# EAGLE design NodegLCD.mega128.v1 (EAGLE 4.13)
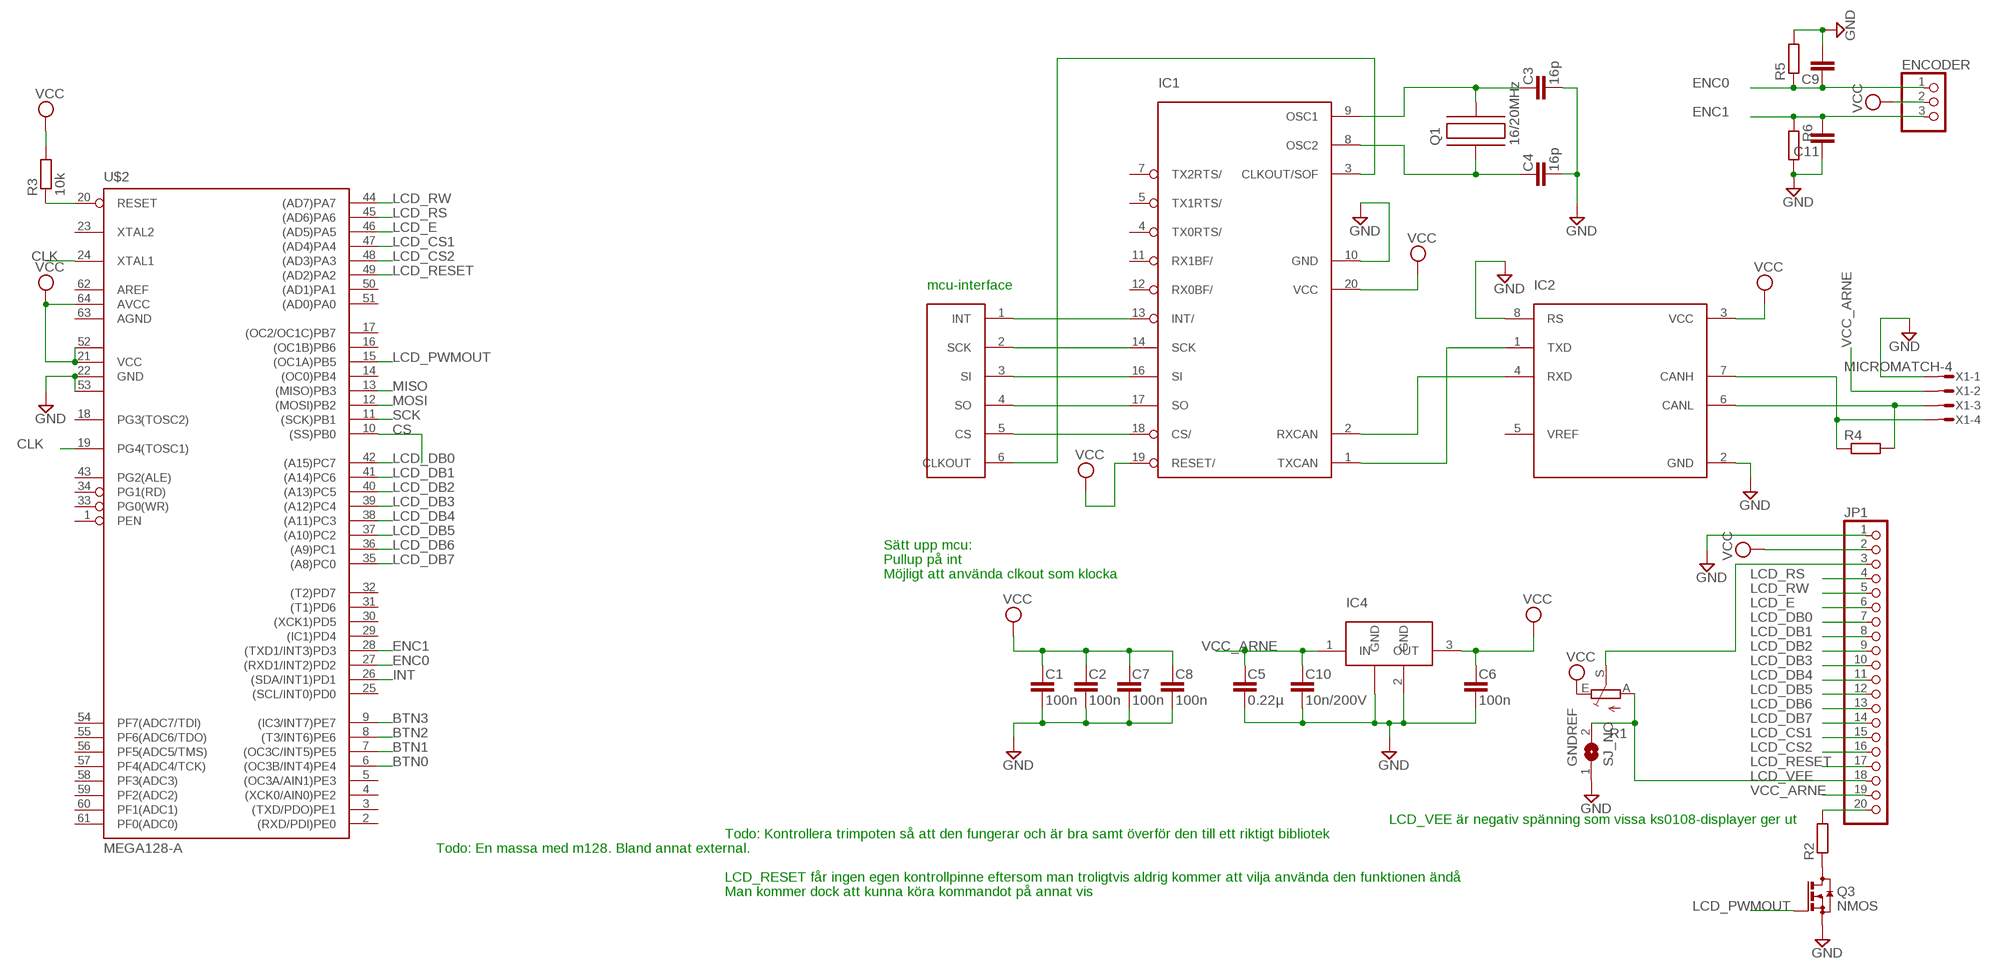
[diagram p0: schematic, sheet 1]

## Parts
C1  100n  C-EU  [C0603]
C2  100n  C-EU  [C0603]
C3  16p  C-EU  [C0603]
C4  16p  C-EU  [C0603]
C5  0.22µ  C-EU  [C0603]
C6  100n  C-EU  [C0603]
C7  100n  C-EU  [C0603]
C8  100n  C-EU  [C0603]
C9  C-EU  [C0603]
C10  10n/200V  C-EU  [C0603]
C11  C-EU  [C0603]
ENCODER  PINHD-1X3  [1X03]
GNDREF  SJ_NO  [SJ_NO]
IC1  MCP2515  [TSSOP]
IC2  MCP2551  [SOIC]
IC4  LM340MP-5.0  [SOT223]
JP1  PINHD-2X10  [2X10]
Q1  16/20MHz  C-MAC-LFA147E  [SMD]
Q3  NMOS  [SOT23]
R1  TRIM_EU-CA9H  [CA9H]
R2  R-EU0207/2V  [0207/2V]
R3  10k  R-EUR0603  [R0603]
R4  R-EUR0603  [R0603]
R5  R-EUR0603  [R0603]
R6  R-EUR0603  [R0603]
U$1  CAN-INTERFACE  [VIA-LIST]
U$2  MEGA128-A  [TQFP64]
X1  MICROMATCH-4  [MICROMATCH-4]

## Nets
BTN0: U$2.6((OC3B/INT4)PE4)
BTN1: U$2.7((OC3C/INT5)PE5)
BTN2: U$2.8((T3/INT6)PE6)
BTN3: U$2.9((IC3/INT7)PE7)
CANH: IC2.7(CANH) R4.1 X1.4
CANL: IC2.6(CANL) R4.2 X1.3
CLK: IC1.3(CLKOUT/SOF) U$1.6(CLKOUT) U$2.19(PG4(TOSC1)) U$2.24(XTAL1)
CS: IC1.18(CS/) U$1.5(CS) U$2.10((SS)PB0)
ENC0: C9.1 ENCODER.1 R5.1 U$2.27((RXD1/INT2)PD2)
ENC1: C11.2 ENCODER.3 R6.1 U$2.28((TXD1/INT3)PD3)
GND: C1.2 C2.2 C3.2 C4.2 C5.2 C6.2 C7.2 C8.2 C9.2 C10.2 C11.1 GNDREF.1 IC1.10(GND) IC2.2(GND) IC2.8(RS) IC4.2(GND) IC4.4(GND) JP1.1 Q3.2(S) R5.2 R6.2 U$2.22(GND) U$2.53(GND1) X1.1
INT: IC1.13(INT/) U$1.1(INT) U$2.26((SDA/INT1)PD1)
LCD_CONTRAST: JP1.3 R1.S
LCD_CS1: JP1.15 U$2.47((AD4)PA4)
LCD_CS2: JP1.16 U$2.48((AD3)PA3)
LCD_DB0: JP1.7 U$2.42((A15)PC7)
LCD_DB1: JP1.8 U$2.41((A14)PC6)
LCD_DB2: JP1.9 U$2.40((A13)PC5)
LCD_DB3: JP1.10 U$2.39((A12)PC4)
LCD_DB4: JP1.11 U$2.38((A11)PC3)
LCD_DB5: JP1.12 U$2.37((A10)PC2)
LCD_DB6: JP1.13 U$2.36((A9)PC1)
LCD_DB7: JP1.14 U$2.35((A8)PC0)
LCD_E: JP1.6 U$2.46((AD5)PA5)
LCD_PWMOUT: Q3.1(G) U$2.15((OC1A)PB5)
LCD_RESET: JP1.17 U$2.49((AD2)PA2)
LCD_RS: JP1.4 U$2.45((AD6)PA6)
LCD_RW: JP1.5 U$2.44((AD7)PA7)
LCD_VEE: GNDREF.2 JP1.18 R1.A
MISO: IC1.17(SO) U$1.4(SO) U$2.13((MISO)PB3)
MOSI: IC1.16(SI) U$1.3(SI) U$2.12((MOSI)PB2)
N$1: IC1.2(RXCAN) IC2.4(RXD)
N$2: IC1.1(TXCAN) IC2.1(TXD)
N$3: Q3.3(D) R2.1
N$4: JP1.20 R2.2
N$5: R3.1 U$2.20(RESET)
N$12: C3.1 IC1.9(OSC1) Q1.P$2
N$13: C4.1 IC1.8(OSC2) Q1.P$1
SCK: IC1.14(SCK) U$1.2(SCK) U$2.11((SCK)PB1)
VCC: C1.1 C2.1 C6.1 C7.1 C8.1 ENCODER.2 IC1.19(RESET/) IC1.20(VCC) IC2.3(VCC) IC4.3(OUT) JP1.2 R1.E R3.2 U$2.21(VCC) U$2.52(VCC1) U$2.64(AVCC)
VCC_ARNE: C5.1 C10.1 IC4.1(IN) JP1.19 X1.2
Unconnected: IC1.4(TX0RTS/) IC1.5(TX1RTS/) IC1.7(TX2RTS/) IC1.11(RX1BF/) IC1.12(RX0BF/) IC2.5(VREF) U$2.1(PEN) U$2.2((RXD/PDI)PE0) U$2.3((TXD/PDO)PE1) U$2.4((XCK0/AIN0)PE2) U$2.5((OC3A/AIN1)PE3) U$2.14((OC0)PB4) U$2.16((OC1B)PB6) U$2.17((OC2/OC1C)PB7) U$2.18(PG3(TOSC2)) U$2.23(XTAL2) U$2.25((SCL/INT0)PD0) U$2.29((IC1)PD4) U$2.30((XCK1)PD5) U$2.31((T1)PD6) U$2.32((T2)PD7) U$2.33(PG0(WR)) U$2.34(PG1(RD)) U$2.43(PG2(ALE)) U$2.50((AD1)PA1) U$2.51((AD0)PA0) U$2.54(PF7(ADC7/TDI)) U$2.55(PF6(ADC6/TDO)) U$2.56(PF5(ADC5/TMS)) U$2.57(PF4(ADC4/TCK)) U$2.58(PF3(ADC3)) U$2.59(PF2(ADC2)) U$2.60(PF1(ADC1)) U$2.61(PF0(ADC0)) U$2.62(AREF) U$2.63(AGND)

## Notes on the sheet
- mcu-interface
- Sätt upp mcu:
- Pullup på int
- Möjligt att använda clkout som klocka
- LCD_VEE är negativ spänning som vissa ks0108-displayer ger ut
- Todo: Kontrollera trimpoten så att den fungerar och är bra samt överför den till ett riktigt bibliotek
- Todo: En massa med m128. Bland annat external.
- LCD_RESET får ingen egen kontrollpinne eftersom man troligtvis aldrig kommer att vilja använda den funktionen ändå
- Man kommer dock att kunna köra kommandot på annat vis

## Library data of the parts
C1-C11 = rcl:C-EU
ENCODER = pinhead-mm:PINHD-1X3
GNDREF = jumper:SJ_NO
IC1 = mcp2515:MCP2515
IC2 = mcp2551:MCP2551
IC4 = lm340mp:LM340MP-5.0
JP1 = pinhead-mm:PINHD-2X10
Q1 = hc49-4h-smx:C-MAC-LFA147E
Q3 = transistor:NMOS
R1 = pot:TRIM_EU-: POTENTIOMETER
R2-R6 = rcl:R-EU
U$1 = can-interface:CAN-INTERFACE
U$2 = avr:MEGA128: MICROCONTROLLER 128 Kbytes FLASH 4 Kbytes SRAM 4 Kbytes EEPROM DUAL USART 8-channel 10 bit ADC
X1 = con-amp-micromatch:MICROMATCH-4: MicroMaTch 4 7-215464-4 / 0-215464-4 Drawing Number C-215464 DDEController.pdf

## Board
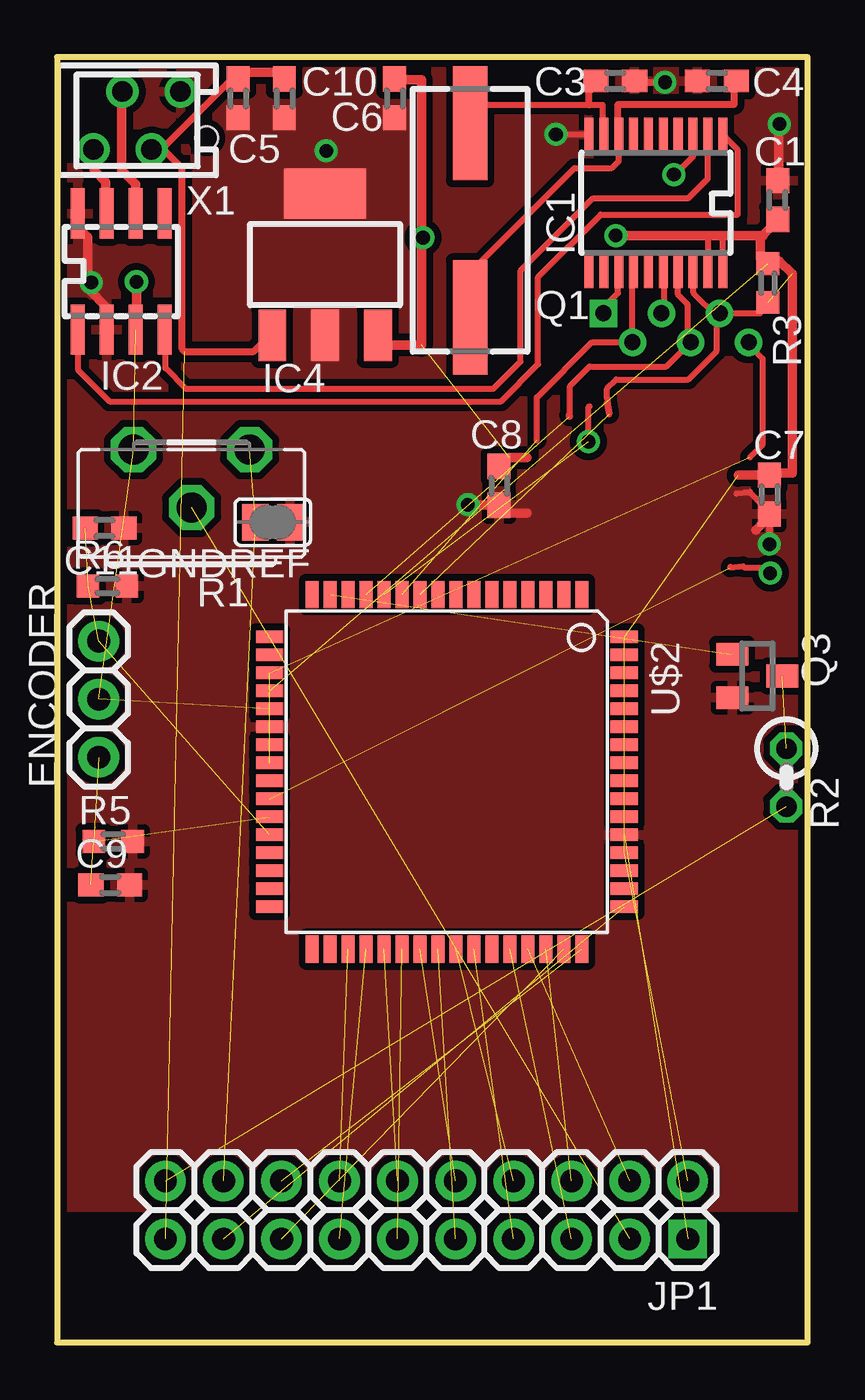
[diagram p1: board, top side]
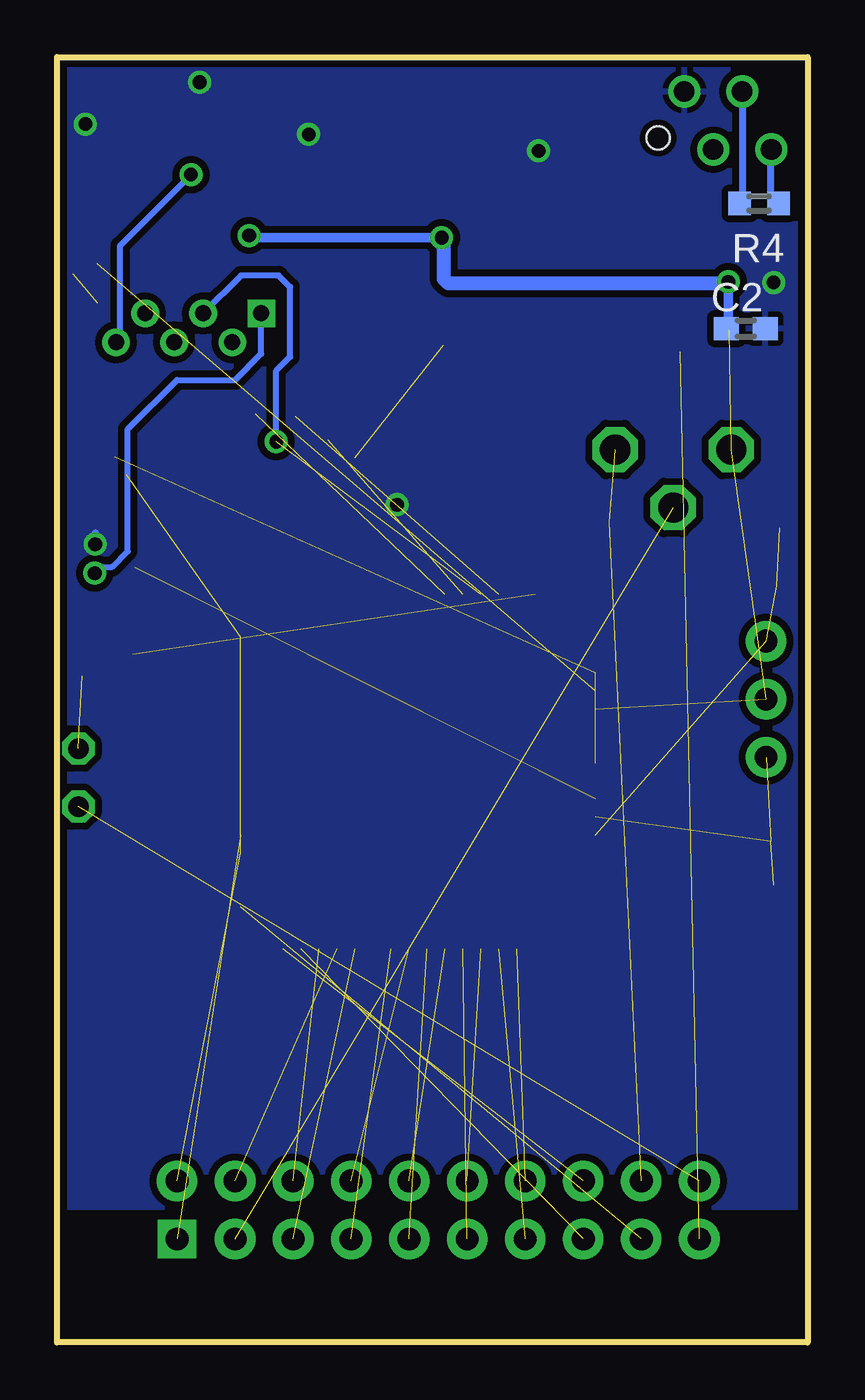
[diagram p2: board, bottom side, seen from below]

Size 32.85 x 56.24 mm. Coordinates in mm from the lower left corner, seen from the top.
Outline: 0,0 32.85,0 32.85,56.24 0,56.24 0,0
Copper layers (1*16): Top 0.035mm / dielectric 1.5mm / Bottom 0.035mm
Design rules "10mils, 0.6drill": minimum track width 10mil, minimum drill 0.6mm, track to track 10mil, track to pad 10mil, pad to pad 10mil, via to via 10mil, smd to smd 10mil, copper to edge 10mil, drill to drill 10mil, minimum pad ring 10mil, minimum via ring 8mil, stop-mask expansion 0mil, vias tented up to drill 0mil, thermal gap 10mil

### Footprints (pad centres in the part's own frame; a part is rotated, then mirrored left to right if it is on the bottom)
C0603 = smd 1.1 x 1: 1 -0.85,0; 2 0.85,0
1X03 = drill 1 pad 1.778 round: 1 -2.54,0; 2 0,0; 3 2.54,0
SJ_NO = smd 1.168 x 1.6: 1 -0.762,0; 2 0.762,0
TSSOP = smd 0.396 x 1.5: 1 -2.925,-2.975; 2 -2.275,-2.975; 3 -1.625,-2.975; 4 -0.975,-2.975; 5 -0.325,-2.975; 6 0.325,-2.975; 7 0.975,-2.975; 8 1.625,-2.975; 9 2.275,-2.975; 10 2.925,-2.975; 11 2.925,2.975; 12 2.275,2.975; 13 1.625,2.975; 14 0.975,2.975; 15 0.325,2.975; 16 -0.325,2.975; 17 -0.975,2.975; 18 -1.625,2.975; 19 -2.275,2.975; 20 -2.925,2.975
SOIC = smd 0.6 x 2.2: 1 -1.905,-2.54; 2 -0.635,-2.54; 3 0.635,-2.54; 4 1.905,-2.54; 5 1.905,2.54; 6 0.635,2.54; 7 -0.635,2.54; 8 -1.905,2.54
SOT223 = smd 1.219 x 2.235: 1 -2.311,-3.099; 2 0,-3.099; 3 2.311,-3.099 | smd 3.6 x 2.2: 4 0,3.099
2X10 = drill 1 pad 1.676 square: 1 -10.16,1.27 | drill 1 pad 1.778 round: 2 -10.16,-1.27; 3 -7.62,1.27; 4 -7.62,-1.27; 5 -5.08,1.27; 6 -5.08,-1.27; 7 -2.54,1.27; 8 -2.54,-1.27; 9 0,1.27; 10 0,-1.27; 11 2.54,1.27; 12 2.54,-1.27; 13 5.08,1.27; 14 5.08,-1.27; 15 7.62,1.27; 16 7.62,-1.27; 17 10.16,1.27; 18 10.16,-1.27; 19 12.7,1.27; 20 12.7,-1.27
SMD = smd 5 x 1.5: P$1 4.25,0; P$2 -4.25,0
SOT23 = smd 1 x 1.4: 1 -0.95,-1.1; 2 0.95,-1.1; 3 0,1.1
CA9H = drill 1.321 octagon: A -2.54,0; E 2.54,0; S 0,2.54
0207/2V = drill 0.9 octagon: 1 -1.27,0; 2 1.27,0
R0603 = smd 0.991 x 1.016: 1 -0.85,0; 2 0.85,0
VIA-LIST = drill 0.7 square: 1 0,2.54 | drill 0.7 round: 2 -1.27,1.27; 3 0,0; 4 -1.27,-1.27; 5 0,-2.54; 6 -1.27,-3.81
TQFP64 = smd 1.194 x 0.559: 1 -7.76,5.905; 2 -7.76,5.118; 3 -7.76,4.331; 4 -7.76,3.543; 5 -7.76,2.756; 6 -7.76,1.968; 7 -7.76,1.181; 8 -7.76,0.394; 9 -7.76,-0.394; 10 -7.76,-1.181; 11 -7.76,-1.968; 12 -7.76,-2.756; 13 -7.76,-3.543; 14 -7.76,-4.331; 15 -7.76,-5.118; 16 -7.76,-5.905; 33 7.76,-5.905; 34 7.76,-5.118; 35 7.76,-4.331; 36 7.76,-3.543; 37 7.76,-2.756; 38 7.76,-1.968; 39 7.76,-1.181; 40 7.76,-0.394; 41 7.76,0.394; 42 7.76,1.181; 43 7.76,1.968; 44 7.76,2.756; 45 7.76,3.543; 46 7.76,4.331; 47 7.76,5.118; 48 7.76,5.905 | smd 0.559 x 1.194: 17 -5.905,-7.76; 18 -5.118,-7.76; 19 -4.331,-7.76; 20 -3.543,-7.76; 21 -2.756,-7.76; 22 -1.968,-7.76; 23 -1.181,-7.76; 24 -0.394,-7.76; 25 0.394,-7.76; 26 1.181,-7.76; 27 1.968,-7.76; 28 2.756,-7.76; 29 3.543,-7.76; 30 4.331,-7.76; 31 5.118,-7.76; 32 5.905,-7.76; 49 5.905,7.76; 50 5.118,7.76; 51 4.331,7.76; 52 3.543,7.76; 53 2.756,7.76; 54 1.968,7.76; 55 1.181,7.76; 56 0.394,7.76; 57 -0.394,7.76; 58 -1.181,7.76; 59 -1.968,7.76; 60 -2.756,7.76; 61 -3.543,7.76; 62 -4.331,7.76; 63 -5.118,7.76; 64 -5.905,7.76
MICROMATCH-4 = drill 0.9 round: 1 1.905,1.27; 2 0.635,-1.27; 3 -0.635,1.27; 4 -1.905,-1.27 | hole 1: 3.048,-0.762

### Placement (x,y rotation side)
C1  31.54,49.99 90 top
C2  2.7,44.36 0 bottom
C3  24.43,55.2 0 top
C4  28.87,55.2 180 top
C5  7.92,54.43 270 top
C6  14.77,54.43 270 top
C7  31.17,37.1 270 top
C8  19.34,37.48 270 top
C9  2.33,20.02 0 top
C10  9.95,54.43 270 top
C11  2.07,35.64 180 top
ENCODER  1.82,28.14 90 top
GNDREF  9.44,35.89 180 top
IC1  26.21,49.86 180 top
IC2  2.8,46.86 0 top
IC4  11.73,47.17 0 top
JP1  17.44,5.79 180 top
Q1  18.08,49.1 270 top
Q3  30.65,29.16 270 top
R1  5.88,39.07 180 top
R2  31.92,24.72 270 top
R3  31.11,46.36 270 top
R4  2.12,49.84 180 bottom
R5  2.46,21.92 0 top
R6  2.2,33.1 0 top
U$1  26.46,45.04 90 top
U$2  17.06,24.97 270 top
X1  3.5,53.47 0 top

### Tracks (layer width: path | path; a pad name or v marks a point on that pad's centre or on a via)
CANH
  Top 0.305: 2.12,49.44 IC2.7 | X1.4 1.62,52.2
  Top 0.406: 2.12,49.44 2.12,50.78 1.62,51.28 1.62,52.2
  Bottom 0.305: X1.4 1.62,52.2 1.62,50.18 R4.1
CANL
  Top 0.305: IC2.6 | X1.3 2.84,54.74
  Top 0.406: IC2.6 3.45,50.67 2.84,51.28 2.84,54.74
  Bottom 0.305: X1.3 2.84,54.74 2.84,49.97 R4.2
CLK  (via drill 0.6)  (2 unrouted)
  Top 0.254: IC1.3 27.83,52.73 27.83,51.89 27.02,51.08 v26.99,51.11 | 30.32,38.74 30.88,39.3 30.88,43.05 30.22,43.71 30.17,43.77
  Top 0.406: 30.17,43.66 30.22,43.71 U$1.6
  Bottom 0.254: v26.99,51.11 30.09,47.98 30.09,43.92 U$1.6
CS  (1 unrouted)
  Top 0.254: IC1.18 27.83,47.01 27.86,47.01 27.86,45.92 28.87,44.91 | 24.07,41.14 24.07,41.12 24.17,40.62 24.07,41.33 24.07,41.73 24.48,42.14 27.63,42.14 28.87,43.38 28.87,44.91 | 28.87,44.91 U$1.5 30.78,45.04 31.03,45.29 31.03,45.49 30.97,45.49
ENC0  (3 unrouted)
ENC1  (3 unrouted)
GND  (via drill 0.6)  (1 unrouted)
  Top 0.254: v21.84,52.86 23.28,52.86 IC1.10 | C1.2 31.59,51.16 | 1.34,46.13 v1.49,46.38 | C8.2 19.8,36.3 | C7.2 31.11,36.58 30.93,36.58 30.32,37.21 29.76,37.16 29.74,37.14 | v31.61,53.32 31.44,53.27 31.59,53.11
  Top 0.305: IC2.2 2.2,44.65 | C3.2 25.45,55.14 v26.61,55.14 | 30.93,36.58 31.16,36.58 31.18,36.55 31.18,36.04 v31.18,34.93
  Top 0.406: 2.2,44.65 2.2,45.26 1.34,46.13 1.34,48.36 0.83,48.87 IC2.8 | 19.8,36.3 20.56,36.3 | 31.59,51.16 31.59,53.11 | 31.18,36.04 31.08,36.04 30.58,35.54 | C8.2 18,36.63 v17.97,36.65
  Bottom 0.305: v26.61,55.14 26.56,55.22 | v31.18,34.93 31.18,35.43
  Bottom 0.406: v17.97,36.65 18.08,36.65
  other vias: 11.78,52.14
  pour Bottom (isolate 0.305): 0.12,56.13 32.83,56.13 32.83,5.94 24.38,5.94 0.12,5.94
  pour Top (isolate 0.305, no thermals): 5.83,55.77 15.89,55.77 15.89,42.05 5.83,42.05
  pour Top (isolate 0.305): 0.17,56.08 32.68,56.08 32.68,5.92 0.17,5.92
INT  (via drill 0.6)  (1 unrouted)
  Top 0.254: IC1.13 | IC1.13 | U$1.1 23.92,45.29 24.55,45.92 24.55,46.86 IC1.13 | 29.48,33.94 29.46,33.91 30.01,33.96 30.07,33.91 30.95,33.91 v31.21,33.66
  Bottom 0.254: v31.21,33.66 30.9,33.94 30.45,33.94 29.76,34.62 29.76,39.96 27.6,42.11 25.06,42.11 23.92,43.26 U$1.1
LCD_CONTRAST  (1 unrouted)
LCD_CS1  (1 unrouted)
LCD_CS2  (1 unrouted)
LCD_DB0  (1 unrouted)
LCD_DB1  (1 unrouted)
LCD_DB2  (1 unrouted)
LCD_DB3  (1 unrouted)
LCD_DB4  (1 unrouted)
LCD_DB5  (1 unrouted)
LCD_DB6  (1 unrouted)
LCD_DB7  (1 unrouted)
LCD_E  (1 unrouted)
LCD_PWMOUT  (1 unrouted)
LCD_RESET  (1 unrouted)
LCD_RS  (1 unrouted)
LCD_RW  (1 unrouted)
LCD_VEE  (2 unrouted)
MISO  (1 unrouted)
  Top 0.254: IC1.17 27.18,46.95 27.17,46.94 27.17,45.85 27.6,45.42 27.6,44.02 27.73,43.89 U$1.4 26.66,42.7 23.31,42.7 22.45,41.84 22.45,40.51 22.44,40.51 22.41,40.51 22.39,40.58
MOSI  (via drill 0.6)  (1 unrouted)
  Top 0.254: IC1.16 26.53,47.01 26.51,46.99 26.51,46.76 26.58,46.69 26.58,45.16 U$1.3 | 23.3,40.96 23.26,40.92 v23.26,39.42
  Bottom 0.254: U$1.3 26.51,45.09 | U$1.3 26.41,44.98 | v23.26,39.42 23.26,42.52 22.65,43.13 22.65,46.18 23.16,46.69 24.81,46.69 U$1.3
N$1
  Top 0.254: 4.77,44.27 4.75,44.27 IC2.4 4.71,44.3 4.74,44.27 4.74,42.62 5.63,41.73 19.09,41.73 20.29,42.93 20.29,46.89 23.46,50.06 27.63,50.06 28.48,50.92 IC1.2
N$2
  Top 0.254: IC1.1 29.79,52.19 29.79,49.35 23.79,49.35 21.05,46.61 21.05,42.8 19.42,41.17 2.3,41.17 0.91,42.57 IC2.1 | IC2.1 0.91,44.38 | IC2.1
N$3  (1 unrouted)
N$4  (1 unrouted)
N$5  (1 unrouted)
N$12
  Top 0.254: IC1.9 23.87,53.19 23.87,54.15 23.28,54.15 18.13,54.15 Q1.P$2
  Top 0.305: C3.1 23.28,54.72 23.28,54.15
N$13
  Top 0.254: Q1.P$1 18.14,46.88 22.65,51.39 24.27,51.39 24.58,51.69 24.58,52.6 24.55,52.63 24.55,52.71
  Top 0.305: IC1.8 24.55,52.71 24.55,54.18 29.63,54.18 29.63,55.23 C4.1
SCK  (1 unrouted)
  Top 0.254: IC1.14 25.23,46.98 25.19,46.94 IC1.14 25.19,46.89 U$1.2 23.41,43.77 21,41.35 21,39.47
VCC  (via drill 0.6)  (8 unrouted)
  Top 0.254: IC1.20 29.12,47.01 29.12,48.44 29.68,48.44 | IC1.19 28.48,46.95 28.49,46.94 28.49,48.44 28.49,48.46 | 30.57,48.49 30.78,48.49 30.9,48.46
  Top 0.406: 15.95,48.34 15.95,43.63 14.08,43.63 14.08,44.32 IC4.3 | IC2.3 3.42,44.71 3.47,45.19 v3.47,46.41 | 15.95,48.34 15.95,55.25 14.83,55.25 14.77,55.2 C6.1 | v16.02,48.34 15.95,48.34 | v24.45,48.44 28.49,48.44 29.68,48.44 | 29.68,48.44 | 20.56,38.71 19.8,38.71 C8.1 | 29.81,37.95 30.7,37.95 C7.1 31.41,38.05 32.17,38.05 32.17,46.76 31.61,47.32 30.88,47.32 | 29.68,48.44 30.78,48.44 | 30.78,48.44 30.9,48.44 30.9,48.46 C1.1 | 30.88,47.32 30.88,47.23 | 30.88,47.32 30.78,47.42 30.78,48.44
  Bottom 0.254: C2.1 3.47,44.86
  Bottom 0.406: 3.47,44.86 3.47,46.33 v3.47,46.41 | v24.45,48.44 24.4,48.44 24.3,48.34 v16.02,48.34
  Bottom 0.61: 3.47,46.33 15.71,46.33 15.92,46.53 15.92,48.34 v16.02,48.34
VCC_ARNE  (1 unrouted)
  Top 0.254: 7.88,55.25 C5.1
  Top 0.305: IC4.1 9.31,44.07 8.61,43.36 5.58,43.36 5.48,43.46 5.48,51.39 4.67,52.2 4.26,52.2 | 7.88,55.25 7.61,55.25 4.56,52.2 4.26,52.2 | 4.26,52.2 X1.2
  Top 0.406: C10.1 9.95,55.58 7.92,55.58 C5.1